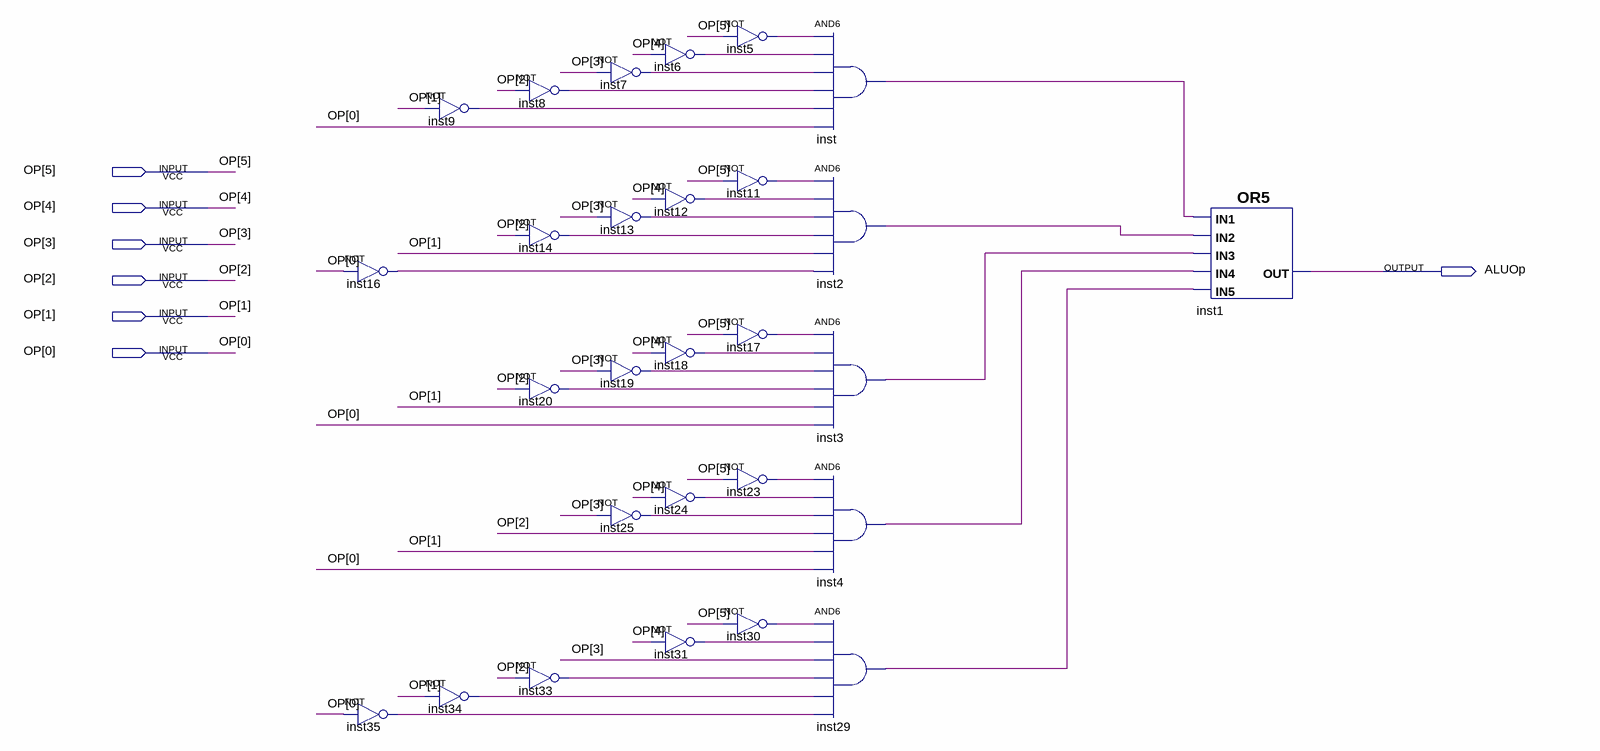
[diagram p0: schematic sheet]
// Quartus schematic ALUOp.bdf as structural Verilog: 28 symbols, 7 pins
module ALUOp (
  input  [5:0] OP,
  output ALUOp
);

  wire inst2_out, inst3_out, inst4_out, inst5_out, inst6_out, inst7_out, inst8_out, inst9_out, inst11_out,
       inst12_out, inst13_out, inst14_out, inst16_out, inst17_out, inst18_out, inst19_out, inst20_out,
       inst23_out, inst24_out, inst25_out, inst29_out, inst30_out, inst31_out, inst33_out, inst34_out,
       inst35_out, inst_out;

  not inst16 (inst16_out, OP[0]);
  not inst35 (inst35_out, OP[0]);
  not inst9 (inst9_out, OP[1]);
  not inst34 (inst34_out, OP[1]);
  not inst8 (inst8_out, OP[2]);
  not inst14 (inst14_out, OP[2]);
  not inst20 (inst20_out, OP[2]);
  not inst33 (inst33_out, OP[2]);
  not inst7 (inst7_out, OP[3]);
  not inst13 (inst13_out, OP[3]);
  not inst19 (inst19_out, OP[3]);
  not inst25 (inst25_out, OP[3]);
  not inst6 (inst6_out, OP[4]);
  not inst12 (inst12_out, OP[4]);
  not inst18 (inst18_out, OP[4]);
  not inst24 (inst24_out, OP[4]);
  not inst31 (inst31_out, OP[4]);
  not inst5 (inst5_out, OP[5]);
  not inst11 (inst11_out, OP[5]);
  not inst17 (inst17_out, OP[5]);
  not inst23 (inst23_out, OP[5]);
  not inst30 (inst30_out, OP[5]);
  and inst (inst_out, inst5_out, inst6_out, inst7_out, inst8_out, inst9_out, OP[0]);
  and inst2 (inst2_out, inst11_out, inst12_out, inst13_out, inst14_out, OP[1], inst16_out);
  and inst3 (inst3_out, inst17_out, inst18_out, inst19_out, inst20_out, OP[1], OP[0]);
  and inst4 (inst4_out, inst23_out, inst24_out, inst25_out, OP[2], OP[1], OP[0]);
  and inst29 (inst29_out, inst30_out, inst31_out, OP[3], inst33_out, inst34_out, inst35_out);
  or inst1 (ALUOp, inst_out, inst2_out, inst3_out, inst4_out, inst29_out);
endmodule
